# EAGLE design long_board_detector (EAGLE 9.6.2)
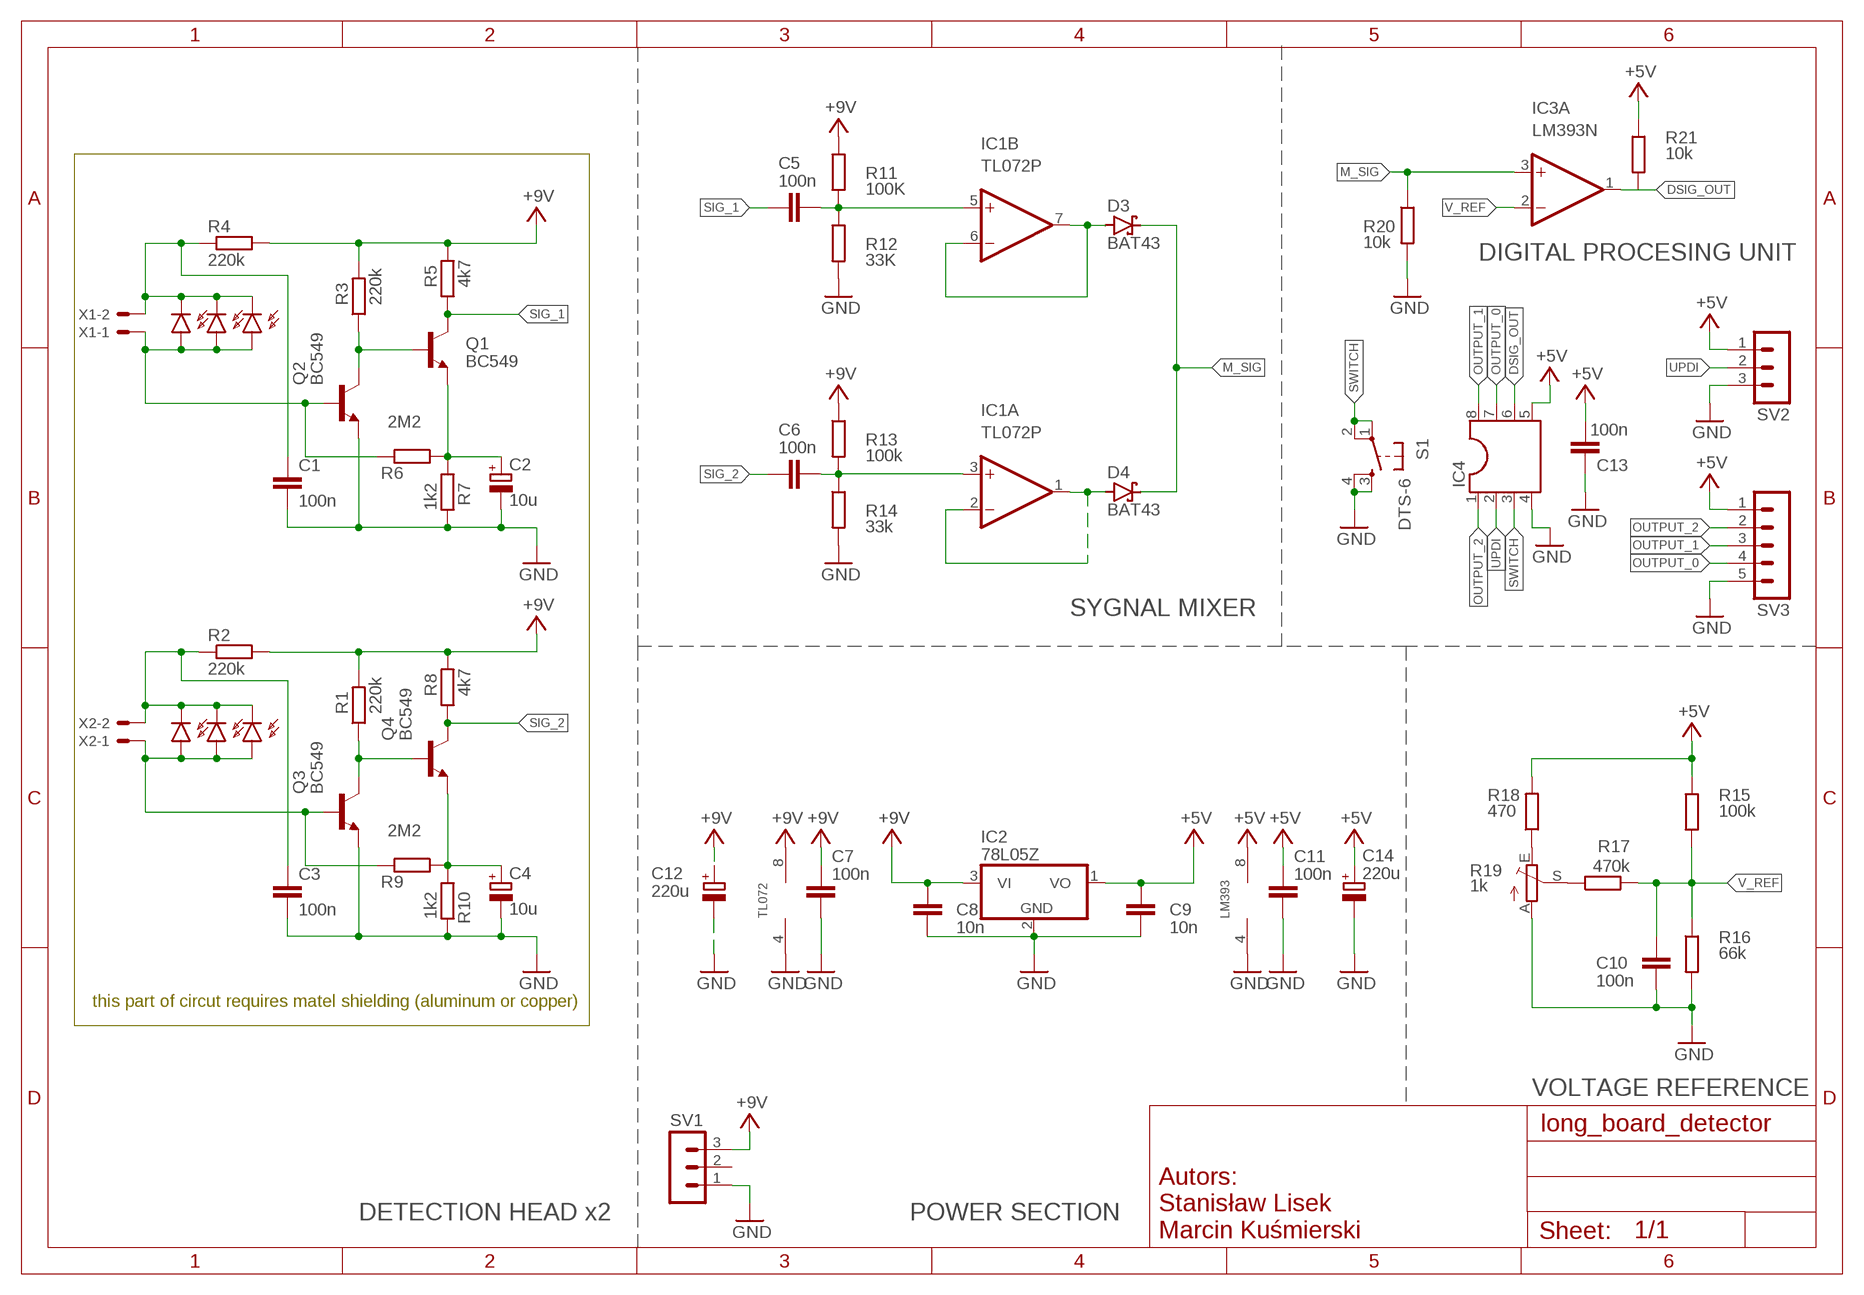
[diagram p0: schematic, sheet 1]

## Parts
C1  100n  C-EU050-025X075  [C050-025X075]
C2  10u  CPOL-EUE2,5-6E  [E2,5-6E]
C3  100n  C-EU050-025X075  [C050-025X075]
C4  10u  CPOL-EUE2,5-6E  [E2,5-6E]
C5  100n  C-EU050-025X075  [C050-025X075]
C6  100n  C-EU050-025X075  [C050-025X075]
C7  100n  C-EU050-025X075  [C050-025X075]
C8  10n  C-EU050-025X075  [C050-025X075]
C9  10n  C-EU050-025X075  [C050-025X075]
C10  100n  C-EU050-025X075  [C050-025X075]
C11  100n  C-EU050-025X075  [C050-025X075]
C12  220u  CPOL-EUE2,5-6E  [E2,5-6E]
C13  100n  C-EU050-025X075  [C050-025X075]
C14  220u  CPOL-EUE2,5-6E  [E2,5-6E]
D1  BPW32  [BPW32]
D2  BPW32  [BPW32]
D3  BAT43  BAT42  [DO35-10]
D4  BAT43  BAT42  [DO35-10]
D5  BPW32  [BPW32]
D6  BPW32  [BPW32]
D7  BPW32  [BPW32]
D8  BPW32  [BPW32]
IC1  TL072P  [DIL08]
IC2  78L05Z  [TO92]
IC3  LM393N  [DIL08]
IC4  DIL8S  [SOCKET-08]
Q1  BC549  BC449  [TO92-EBC]
Q2  BC549  BC449  [TO92-EBC]
Q3  BC549  BC449  [TO92-EBC]
Q4  BC549  BC449  [TO92-EBC]
R1  220k  R-EU_0204/7  [0204/7]
R2  220k  R-EU_0204/7  [0204/7]
R3  220k  R-EU_0204/7  [0204/7]
R4  220k  R-EU_0204/7  [0204/7]
R5  4k7  R-EU_0204/7  [0204/7]
R6  2M2  R-EU_0204/7  [0204/7]
R7  1k2  R-EU_0204/7  [0204/7]
R8  4k7  R-EU_0204/7  [0204/7]
R9  2M2  R-EU_0204/7  [0204/7]
R10  1k2  R-EU_0204/7  [0204/7]
R11  100K  R-EU_0204/7  [0204/7]
R12  33K  R-EU_0204/7  [0204/7]
R13  100k  R-EU_0204/7  [0204/7]
R14  33k  R-EU_0204/7  [0204/7]
R15  100k  R-EU_0204/7  [0204/7]
R16  66k  R-EU_0204/7  [0204/7]
R17  470k  R-EU_0204/7  [0204/7]
R18  470  R-EU_0204/7  [0204/7]
R19  1k  TRIM_EU-CA6V  [CA6V]
R20  10k  R-EU_0204/7  [0204/7]
R21  10k  R-EU_0204/7  [0204/7]
S1  DTS-6  [DTS-6]
SV1  MA03-1  [MA03-1]
SV2  MA03-1  [MA03-1]
SV3  MA05-1  [MA05-1]
X1  22-23-2021  [22-23-2021]
X2  22-23-2021  [22-23-2021]

## Nets
+3V3: C9.1 C11.2 C13.2 C14.+ IC2.1(VO) IC3.8(P:V+) IC4.5 R15.1 R18.2 R21.1 SV2.1 SV3.1 ; supply symbol labelled +5V
+5V: C7.2 C8.1 C12.+ IC1.8(P:V+) IC2.3(VI) R1.2 R2.2 R3.2 R4.2 R5.2 R8.2 R11.1 R13.1 SV1.3 ; supply symbol labelled +9V
DSIG_OUT: IC3.1(A:OUT) IC4.6 R21.2
GND: C1.2 C2.- C3.2 C4.- C7.1 C8.2 C9.2 C10.2 C11.1 C12.- C13.1 C14.- IC1.4(P:V-) IC2.2(GND) IC3.4(P:V-) IC4.4 Q2.E Q3.E R7.2 R10.2 R12.2 R14.2 R16.2 R19.A R20.2 S1.3 S1.4 SV1.1 SV2.3 SV3.5
M_SIG: D3.C D4.C IC3.3(A:+IN) R20.1
N$1: D6.A D7.A D8.A Q3.B R9.2 X2.1
N$2: C5.2 IC1.5(B:+IN) R11.2 R12.1
N$3: Q1.B Q2.C R3.1
N$4: D1.A D2.A D5.A Q2.B R6.2 X1.1
N$5: D4.A IC1.1(A:OUT) IC1.2(A:-IN)
N$6: D3.A IC1.6(B:-IN) IC1.7(B:OUT)
N$7: C2.+ Q1.E R6.1 R7.1
N$9: C6.2 IC1.3(A:+IN) R13.2 R14.1
N$11: C1.1 D1.K(C) D2.K(C) D5.K(C) R4.1 X1.2
N$12: C3.1 D6.K(C) D7.K(C) D8.K(C) R2.1 X2.2
N$13: Q3.C Q4.B R1.1
N$14: C4.+ Q4.E R9.1 R10.1
N$16: R17.1 R19.S
N$17: R18.1 R19.E
OUTPUT_0: IC4.7 SV3.4
OUTPUT_1: IC4.8 SV3.3
OUTPUT_2: IC4.1 SV3.2
SIG_1: C5.1 Q1.C R5.1
SIG_2: C6.1 Q4.C R8.1
SWITCH: IC4.3 S1.1 S1.2
UPDI: IC4.2 SV2.2
V_REF: C10.1 IC3.2(A:-IN) R15.2 R16.1 R17.2
Unconnected: IC3.5(B:+IN) IC3.6(B:-IN) IC3.7(B:OUT) SV1.2

## Notes on the sheet
- DIGITAL PROCESING UNIT
- SYGNAL MIXER
- TL072 | LM393
- this part of circut requires matel shielding (aluminum or copper)
- VOLTAGE REFERENCE
- DETECTION HEAD x2 | POWER SECTION
- Autors:
  Stanisław Lisek
  Marcin Kuśmierski

## Library data of the parts
C1 C3 C5-C11 C13 = rcl:C-EU: CAPACITOR, European symbol; SPICEPREFIX: C
C2 C4 C12 C14 = rcl:CPOL-EU: POLARIZED CAPACITOR, European symbol; SPICEPREFIX: C
D1 D2 D5-D8 = opto-trans-siemens:BPW32: PHOTO DIODE; OC_FARNELL: unknown; OC_NEWARK: unknown
D3 D4 = diode:BAT42: DIODE barrier diode
IC1 = linear:TL072: OP AMP
IC2 = linear:78*: Positive VOLTAGE REGULATOR Source: http://cache.national.com/ds/LM/LM78L05.pdf http://www.fairchildsemi.com/ds/LM/LM7805.pdf
IC3 = linear:LM393: COMPARATOR
IC4 = ic-package:DIL8: Dual In Line / Socket
Q1-Q4 = transistor-npn:BC449*: NPN Transistor
R1-R18 R20 R21 = rcl:R-EU_: RESISTOR, European symbol; SPICEPREFIX: R
R19 = pot:TRIM_EU-: POTENTIOMETER
S1 = switch-tact:DTS-6
SV1 SV2 = con-lstb:MA03-1: PIN HEADER; OC_FARNELL: unknown; OC_NEWARK: unknown
SV3 = con-lstb:MA05-1: PIN HEADER; OC_FARNELL: unknown; OC_NEWARK: unknown
X1 X2 = con-molex:22-23-2021: .100" (2.54mm) Center Header - 2 Pin; MF: MOLEX; MPN: 22-23-2021; OC_FARNELL: 1462926; OC_NEWARK: 25C3832

## Board
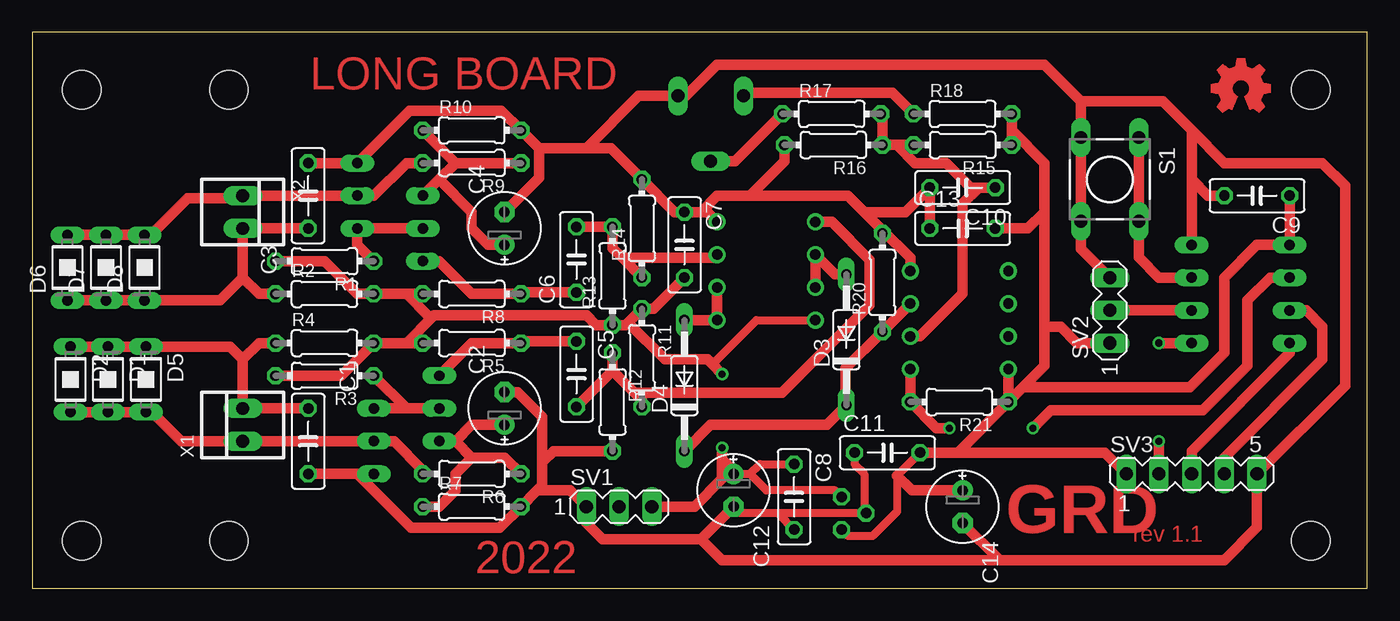
[diagram p1: board, top side]
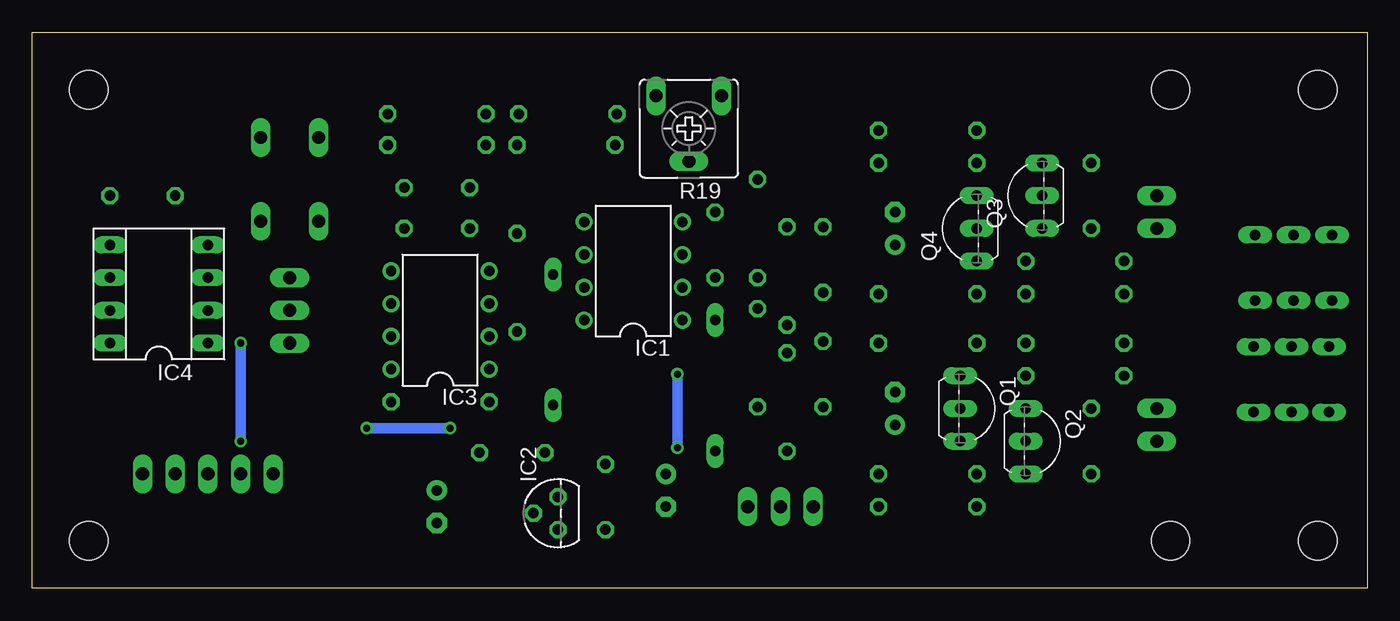
[diagram p2: board, bottom side, seen from below]

Size 103.65 x 43.17 mm. Coordinates in mm from the lower left corner, seen from the top.
Outline: 0,0 103.65,0 103.65,43.17 0,43.17 0,0
Copper layers (1*16): Top 0.035mm / dielectric 1.5mm / Bottom 0.035mm
Design rules "default": minimum track width 6mil, minimum drill 0.35mm, track to track 6mil, track to pad 6mil, pad to pad 6mil, via to via 6mil, smd to smd 6mil, copper to edge 40mil, drill to drill 6mil, minimum pad ring 10mil, minimum via ring 8mil, stop-mask expansion 4mil, vias tented up to drill 0mil, thermal gap 10mil
Holes 3 mm at 99.27,3.71 99.27,38.71 15.27,38.71 15.27,3.71 3.84,38.71 3.84,3.71

### Footprints (pad centres in the part's own frame; a part is rotated, then mirrored left to right if it is on the bottom)
C050-025X075 = drill 0.813 octagon: 1 -2.54,0; 2 2.54,0
E2,5-6E = drill 0.813 pad 1.575: + -1.27,0 | drill 0.813 pad 1.575 octagon: - 1.27,0
BPW32 = drill 0.813 long: A 0,2.54; K 0,-2.54
DO35-10 = drill 0.813 long: A 5.08,0; C -5.08,0
DIL08 = drill 0.813 pad 1.27: 1 -3.81,-3.81; 2 -1.27,-3.81; 3 1.27,-3.81; 4 3.81,-3.81; 5 3.81,3.81; 6 1.27,3.81; 7 -1.27,3.81; 8 -3.81,3.81
TO92 = drill 0.813 octagon: 1 -1.27,0; 2 0,1.905; 3 1.27,0
SOCKET-08 = drill 0.813 long: 1 -3.81,-3.81; 2 -1.27,-3.81; 3 1.27,-3.81; 4 3.81,-3.81; 5 3.81,3.81; 6 1.27,3.81; 7 -1.27,3.81; 8 -3.81,3.81
TO92-EBC = drill 0.813 long: B 0,-1.27; C -2.54,-1.27; E 2.54,-1.27
0204/7 = drill 0.813 octagon: 1 -3.81,0; 2 3.81,0
CA6V = drill 1.016 long: A -2.54,-2.54; E 2.54,-2.54; S 0,2.54
DTS-6 = drill 1 long: 1 -3.25,2.25; 2 3.25,2.25; 3 -3.25,-2.25; 4 3.25,-2.25
MA03-1 = drill 1.016 long: 1 -2.54,0; 2 0,0; 3 2.54,0
MA05-1 = drill 1.016 long: 1 -5.08,0; 2 -2.54,0; 3 0,0; 4 2.54,0; 5 5.08,0
22-23-2021 = drill 1 long: 1 -1.27,0; 2 1.27,0

### Placement (x,y rotation side)
C1  21.43,11.43 270 top
C2  36.67,13.97 90 top
C3  21.43,30.48 90 top
C4  36.67,27.94 90 top
C5  42.26,16.64 270 top
C6  42.26,25.53 90 top
C7  50.64,26.67 270 top
C8  59.15,7.11 270 top
C9  95.09,30.48 180 top
C10  72.23,31.12 180 top
C11  66.39,10.54 0 top
C12  54.45,7.62 270 top
C13  72.23,27.94 0 top
C14  72.23,6.35 270 top
D1  5.89,16.23 180 top
D2  2.98,16.23 180 top
D3  63.21,19.3 90 top
D4  50.64,15.75 90 top
D5  8.84,16.23 180 top
D6  2.73,24.9 0 top
D7  5.73,24.9 0 top
D8  8.73,24.9 0 top
IC1  56.99,24.64 90 bottom
IC2  62.83,5.84 90 bottom
IC3  71.98,20.83 90 bottom
IC4  93.82,22.86 90 bottom
Q1  30.32,13.97 270 bottom
Q2  25.24,11.43 270 bottom
Q3  26.51,30.48 90 bottom
Q4  31.59,27.94 90 bottom
R1  22.7,25.4 180 top
R2  22.7,22.86 0 top
R3  22.7,16.51 180 top
R4  22.7,19.05 0 top
R5  34.13,19.05 180 top
R6  34.13,8.89 180 top
R7  34.13,6.35 0 top
R8  34.13,22.86 180 top
R9  34.13,33.02 180 top
R10  34.13,35.56 0 top
R11  47.34,17.91 270 top
R12  45.05,14.48 270 top
R13  45.05,24.26 90 top
R14  47.34,27.94 90 top
R15  72.23,34.42 180 top
R16  62.2,34.42 180 top
R17  62.07,36.83 0 top
R18  72.23,36.83 0 top
R19  52.67,35.69 180 bottom
R20  66.01,23.75 90 top
R21  71.98,14.48 180 top
S1  83.66,31.75 270 top
SV1  45.56,6.35 0 top
SV2  83.66,21.59 90 top
SV3  90.01,8.89 0 top
X1  16.35,12.7 90 top
X2  16.35,29.21 270 top

### Tracks (layer width: path | path; a pad name or v marks a point on that pad's centre or on a via)
+3V3
  Top 0.61: C11.2 67.15,8.76 67.15,5.97 65.24,4.06 63.34,4.06 IC2.1
  Top 0.813: IC3.8 R21.1 | R21.1 71.85,10.54 | C11.2 71.85,10.54 | R18.2 76.04,35.56 | 76.04,35.56 R15.1 | 76.04,35.56 78.58,33.02 78.58,29.21 | 76.93,15.62 78.58,17.27 78.58,20.32 | 76.93,15.62 R21.1 | 78.58,29.21 78.58,20.32 | 78.58,29.21 77.31,27.94 C13.2 | 78.58,20.32 79.85,20.32 81.12,19.05 SV2.1 | 76.93,15.62 89.88,15.62 92.55,18.29 92.55,24.13 95.09,26.67 IC4.5 C9.1 | 71.85,10.54 83.28,10.54 SV3.1 | 67.15,8.76 68.29,7.62 C14.+
+5V  (via drill 0.55)
  Top 0.61: 53.56,10.16 54.45,9.27 C12.+ 55.72,8.89 | 55.72,8.89 56.99,7.62 62.32,7.62 IC2.3 | 55.72,8.89 56.48,9.65 C8.1 | 52.8,17.4 56.23,20.83 IC1.8
  Top 0.813: R1.2 22.7,25.4 25.24,22.86 R2.2 29.05,22.86 | 29.05,22.86 R8.2 | R3.2 20.16,16.51 23.97,16.51 R4.2 29.05,19.05 | 29.05,19.05 R5.2 | 29.05,22.86 30.83,21.08 31.08,21.08 | 29.05,19.05 31.08,21.08 | 31.08,21.08 31.21,21.21 43.02,21.21 43.78,20.45 R13.1 46.07,20.45 46.26,20.64 | 46.26,20.64 R11.1 48.23,21.72 C7.2 | 46.26,20.64 49.12,17.78 52.42,17.78 52.8,17.4 v53.56,16.64 | SV1.3 51.4,6.35 53.56,8.51 53.56,8.89 | v53.56,10.92 53.56,10.16 53.56,8.89 | 53.56,8.89 C12.+
  Bottom 0.813: v53.56,16.64 v53.56,10.92
DSIG_OUT  (via drill 0.55)
  Top 0.813: IC3.1 R21.2 70.2,12.45 v71.21,12.45 | IC4.6 96.11,24.13 94.33,22.35 94.33,17.3 90.87,13.84 79.09,13.84 v77.69,12.45
  Bottom 0.813: v71.21,12.45 v77.69,12.45
GND
  Top 0.61: C12.- 54.96,5.84 57.88,5.84 | IC2.2 64.61,5.84 | 64.61,5.84 57.88,5.84 | 57.88,5.84 C8.2 | C11.1 63.85,9.65 64.61,8.89 64.61,5.84
  Top 0.813: C3.2 Q3.E 29.3,37.08 36.42,37.08 R10.2 39.34,34.16 | 39.34,34.16 39.34,31.88 C4.- | C1.2 25.24,8.89 | 25.24,8.89 Q2.E | 25.24,8.89 29.43,4.7 36.29,4.7 R7.2 39.21,7.62 | C2.- 37.69,15.24 39.59,13.34 39.59,9.78 | 39.59,9.78 39.59,8 39.21,7.62 | 39.59,9.78 40.48,10.67 R12.2 | 39.34,34.16 43.02,34.16 | 43.02,34.16 44.92,34.16 R14.2 49.88,29.21 C7.1 51.91,29.21 | 39.21,7.62 41.75,7.62 SV1.1 43.02,5.08 44.29,3.81 51.91,3.81 | C12.- 51.91,3.81 | 51.91,29.21 52.42,29.21 IC1.4 | 51.91,29.21 53.18,30.48 55.72,30.48 | 55.72,30.48 63.34,30.48 64.61,29.21 | IC3.4 68.17,25.65 66.01,27.81 | 64.61,29.21 66.01,27.81 | 66.01,27.81 R20.2 | C13.1 C10.2 67.78,29.21 64.61,29.21 | 43.02,34.16 47.08,38.23 R19.A 50.77,38.23 53.18,40.64 78.58,40.64 81.41,37.81 | R16.2 58.39,33.15 55.72,30.48 | SV2.3 81.41,26.38 S1.4 S1.3 81.41,37.81 | 81.41,37.81 87.76,37.81 90.01,35.56 | 90.01,31.75 90.01,35.56 | 90.01,31.75 IC4.4 | 90.01,31.75 91.28,30.48 C9.2 | 90.01,35.56 92.55,33.02 100.17,33.02 101.95,31.24 101.95,15.75 SV3.5 95.09,4.74 92.54,2.18 75.13,2.18 | 51.91,3.81 53.54,2.18 75.13,2.18 | C14.- 75.13,2.18
M_SIG
  Top 0.813: D4.C 52.67,12.7 61.69,12.7 63.15,14.16 | 63.15,14.16 D3.C | IC3.3 R20.1 63.15,17.08 63.15,14.16
N$1
  Top 0.813: R9.2 29.05,33.02 26.51,30.48 Q3.B X2.1 16.14,30.27 12.07,30.27 9.24,27.44 D7.A | D6.A D7.A | D7.A D8.A 9.5,27.44
N$2
  Top 0.813: C5.2 45.05,16.89 | 45.05,16.89 R12.1 | 45.05,16.89 46.77,15.18 | 46.77,15.18 47.34,14.61 R11.2 | 46.77,15.18 58.2,15.18 64.99,21.97 64.99,25.53 62.07,28.45 IC1.5
N$3
  Top 0.813: R3.1 29.05,13.97 | 29.05,13.97 Q1.B | 29.05,13.97 Q2.C
N$4
  Top 0.813: D2.A D1.A D5.A 9.31,13.69 11.57,11.43 X1.1 Q2.B 28.08,11.43 30.32,9.19 R6.2
N$5
  Top 0.813: 51.15,20.83 D4.A IC1.1 IC1.2
N$6
  Top 0.813: IC1.7 IC1.6 62.32,24.38 D3.A
N$7
  Top 0.813: Q1.E 32.86,11.43 | 32.86,11.43 34.13,10.16 | R6.1 36.67,10.16 34.13,10.16 | C2.+ 34.13,12.7 32.86,11.43 | 34.13,10.16 32.86,8.89 32.86,7.62 31.59,6.35 R7.1
N$9
  Top 0.813: C6.2 R13.2 45.05,26.42 45.81,25.65 | 45.81,25.65 R14.1 | 45.81,25.65 52.93,25.65 IC1.3
N$11
  Top 0.813: 16.35,17.78 17.62,19.05 R4.1 | 16.35,17.78 X1.2 C1.1 | D2.K D1.K D5.K 15.36,18.77 16.35,17.78
N$12
  Top 0.813: 16.35,24.13 X2.2 C3.1 | 16.35,24.13 17.62,22.86 R2.1 | D6.K D7.K D8.K 14.58,22.36 16.35,24.13
N$13
  Top 0.813: R1.1 25.24,26.67 Q3.C Q4.B
N$14
  Top 0.813: Q4.E 31.59,31.75 | 31.59,31.75 32.86,33.02 | 32.86,33.02 R9.1 | R10.1 32.86,33.02 | C4.+ 35.4,26.67 34.13,27.94 34.13,29.21 31.59,31.75
N$16
  Top 0.813: R19.S 54.58,33.15 R17.1
N$17
  Top 0.813: R19.E 55.47,38.48 66.77,38.48 R18.1
OUTPUT_0
  Top 0.813: IC4.7 98.9,21.59 100.17,20.32 100.17,17.78 92.55,10.16 SV3.4
OUTPUT_1
  Top 0.813: SV3.3 90.01,10.67 97.63,18.29 IC4.8
OUTPUT_2  (via drill 0.55)
  Top 0.813: IC4.1 v87.47,19.05 | v87.47,11.43 SV3.2
  Bottom 0.813: v87.47,19.05 v87.47,11.43
SIG_1
  Top 0.813: Q1.C 34.13,19.05 R5.1 38.07,19.18 C5.1
SIG_2
  Top 0.813: Q4.C 31.59,25.4 34.13,22.86 R8.1 38.07,22.99 C6.1
SWITCH
  Top 0.813: S1.1 S1.2 85.91,25.69 87.47,24.13 IC4.3
UPDI
  Top 0.813: SV2.2 IC4.2
V_REF
  Top 0.813: R17.2 66.01,36.7 R16.1 67.15,34.42 | 67.15,34.42 R15.2 | 67.15,34.42 68.55,33.02 70.96,33.02 72.86,31.12 73.5,31.12 | 73.5,31.12 C10.1 | 73.5,31.12 72.23,29.84 72.23,22.86 68.93,19.56 IC3.2
(copper drawn outside any net)
  shapes: Top area x303

### Text on the board
Top: LONG BOARD | GRD | rev 1.1 | 2022